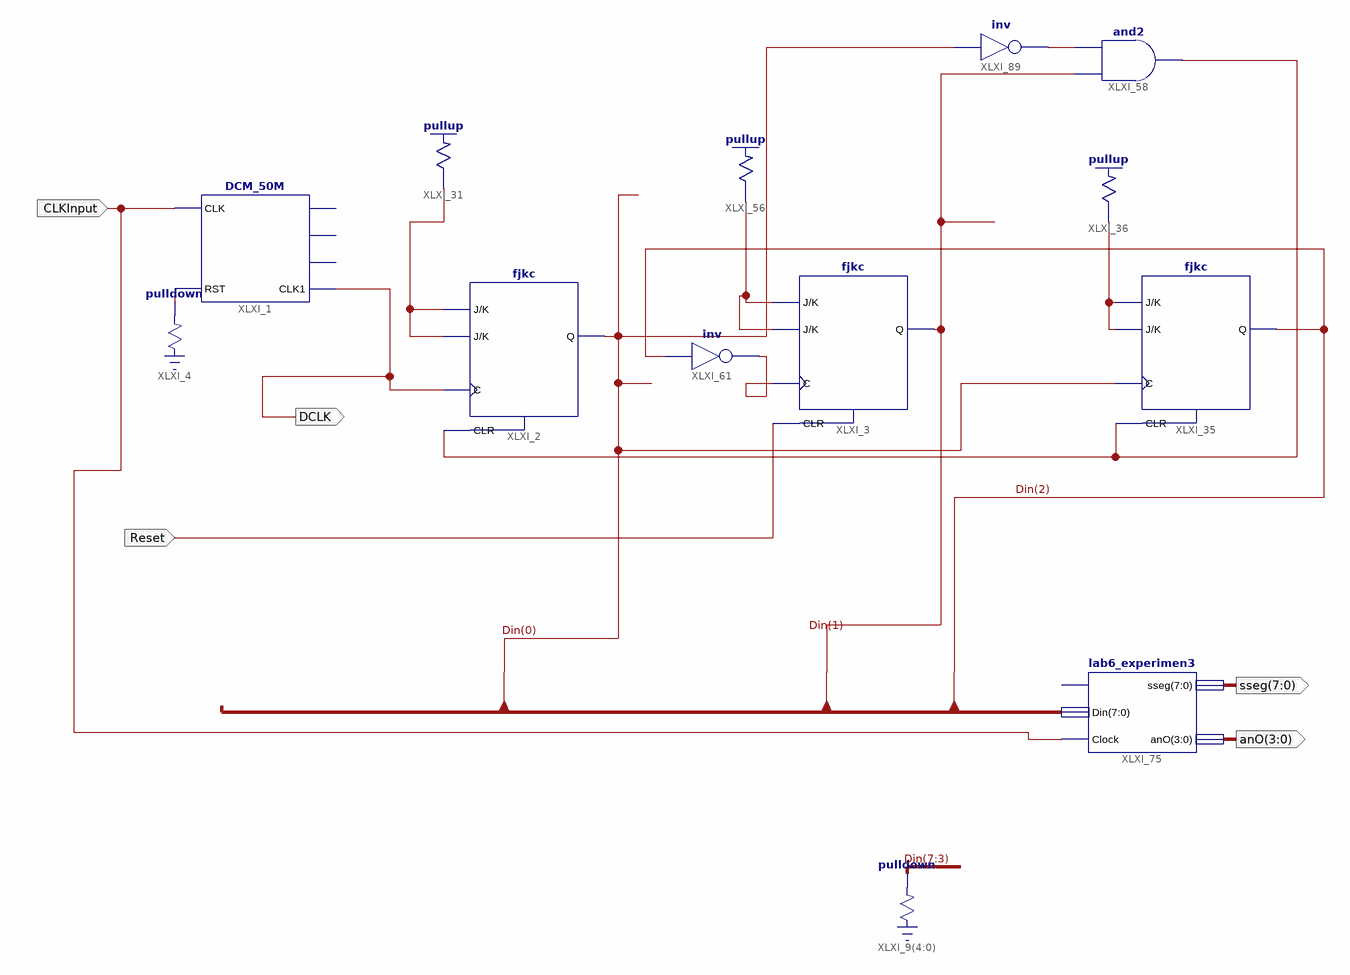
[diagram p0: schematic sheet 1]
// Xilinx ISE schematic lab8_experiment4.sch (spartan3e) as structural Verilog: 13 symbols, 5 ports
module lab8_experiment4 (
  input  CLKInput,
  input  Reset,
  output DCLK,
  output [7:0] sseg,
  output [3:0] anO
);

  wire XLXN_38, XLXN_39, XLXN_48, XLXN_91, XLXN_145, XLXN_148, XLXN_150;
  wire [7:0] Din;

  DCM_50M XLXI_1 (.CLK(CLKInput), .RST(XLXN_38), .CLK1(DCLK));  // open: CLK1M, CLK10k, CLK1k
  fjkc XLXI_2 (.C(DCLK), .CLR(XLXN_150), .J(XLXN_39), .K(XLXN_39), .Q(Din[0]));
  fjkc XLXI_3 (.C(XLXN_145), .CLR(Reset), .J(XLXN_91), .K(XLXN_91), .Q(Din[1]));
  \pulldown  XLXI_4 (.O(XLXN_38));
  \pullup  XLXI_31 (.O(XLXN_39));
  fjkc XLXI_35 (.C(Din[0]), .CLR(XLXN_150), .J(XLXN_48), .K(XLXN_48), .Q(Din[2]));
  \pullup  XLXI_36 (.O(XLXN_48));
  \pullup  XLXI_56 (.O(XLXN_91));
  not XLXI_61 (XLXN_145, Din[2]);
  and XLXI_58 (XLXN_150, Din[1], XLXN_148);
  not XLXI_89 (XLXN_148, Din[0]);
  lab6_experimen3 XLXI_75 (.Din(Din), .Clock(CLKInput), .sseg(sseg), .anO(anO));  // open: En
  \pulldown  XLXI_9[4:0] (.O(Din[7:3]));
endmodule
